# EAGLE design sdlc (EAGLE 4.16)
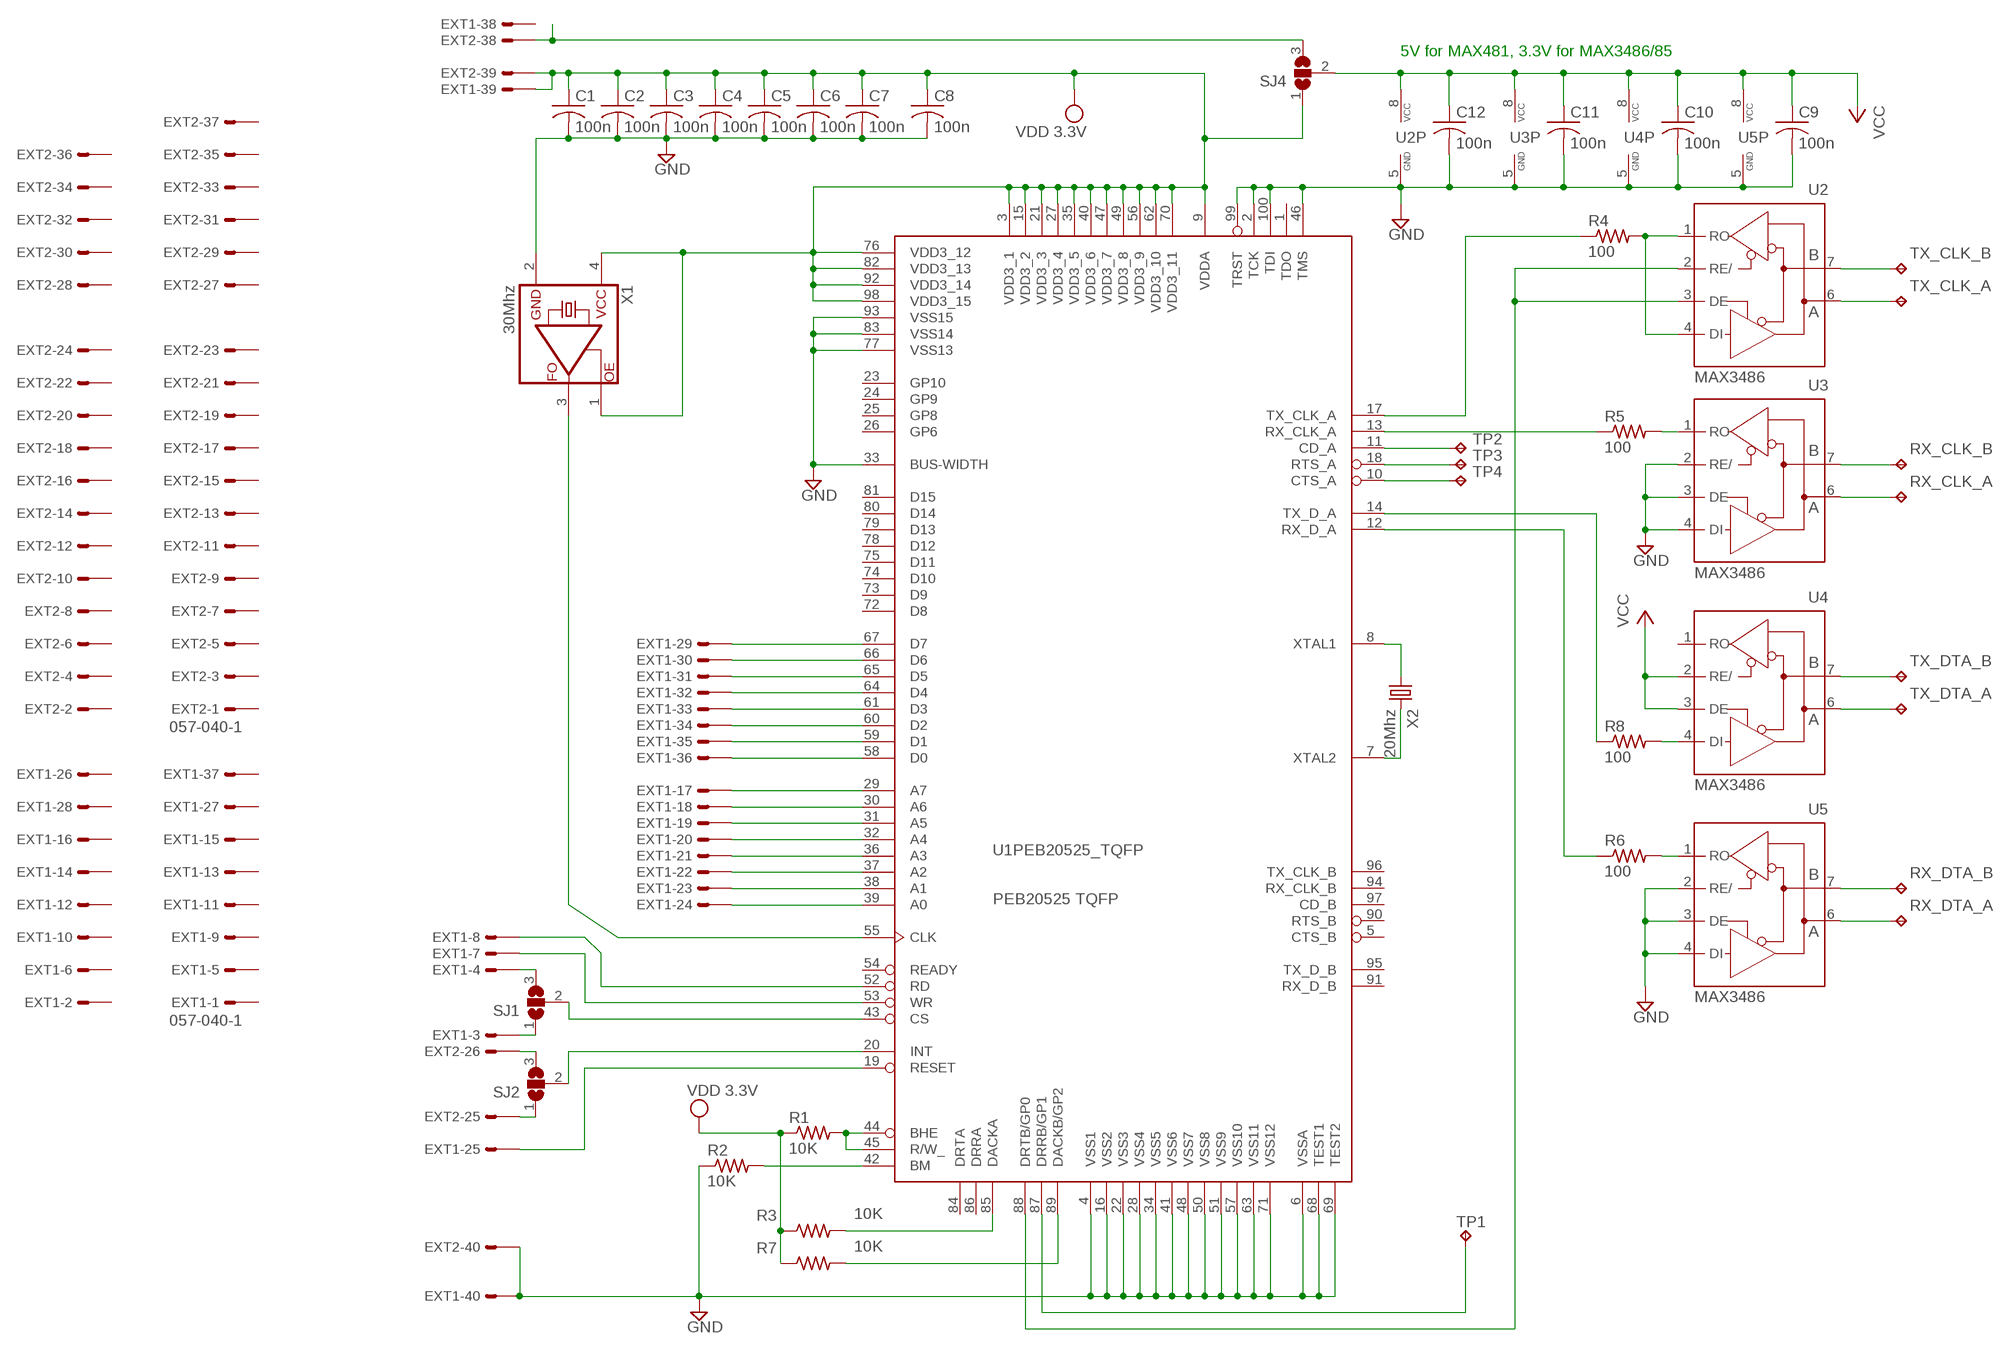
[diagram p0: schematic, sheet 1]

## Parts
C1  100n  C-USC1206  [C1206]
C2  100n  C-USC1206  [C1206]
C3  100n  C-USC1206  [C1206]
C4  100n  C-USC1206  [C1206]
C5  100n  C-USC1206  [C1206]
C6  100n  C-USC1206  [C1206]
C7  100n  C-USC1206  [C1206]
C8  100n  C-USC1206  [C1206]
C9  100n  C-USC1206  [C1206]
C10  100n  C-USC1206  [C1206]
C11  100n  C-USC1206  [C1206]
C12  100n  C-USC1206  [C1206]
EXT1  057-040-1  [057-040-1]
EXT2  057-040-1  [057-040-1]
R1  10K  R-US_M0805  [M0805]
R2  10K  R-US_M0805  [M0805]
R3  10K  R-US_M0805  [M0805]
R4  100  R-US_M0805  [M0805]
R5  100  R-US_M0805  [M0805]
R6  100  R-US_M0805  [M0805]
R7  10K  R-US_M0805  [M0805]
R8  100  R-US_M0805  [M0805]
RX_CLK_A  TPPAD1-13  [P1-13]
RX_CLK_B  TPPAD1-13  [P1-13]
RX_DTA_A  TPPAD1-13  [P1-13]
RX_DTA_B  TPPAD1-13  [P1-13]
SJ1  SJ2W  [SJ_2]
SJ2  SJ2W  [SJ_2]
SJ4  SJ2W  [SJ_2]
TP1  TPPAD1-13  [P1-13]
TP2  TPPAD1-13  [P1-13]
TP3  TPPAD1-13  [P1-13]
TP4  TPPAD1-13  [P1-13]
TX_CLK_A  TPPAD1-13  [P1-13]
TX_CLK_B  TPPAD1-13  [P1-13]
TX_DTA_A  TPPAD1-13  [P1-13]
TX_DTA_B  TPPAD1-13  [P1-13]
U1  PEB20525 TQFP  PEB20525PEB20525-TQFP  [TQFP100]
U2  MAX3486  [SO08]
U3  MAX3486  [SO08]
U4  MAX3486  [SO08]
U5  MAX3486  [SO08]
X1  30Mhz  CB3LV  [SMD7.5X5MM]
X2  20Mhz  CRYSTALHC49S  [HC49/S]

## Nets
GND: C1.2 C2.2 C3.2 C4.2 C5.2 C6.2 C7.2 C8.2 C9.2 C10.2 C11.2 C12.2 EXT1.40 EXT2.40 R2.1 U1.2(TCK) U1.4(VSS1) U1.6(VSSA) U1.16(VSS2) U1.22(VSS3) U1.28(VSS4) U1.33(BUS-WIDTH) U1.34(VSS5) U1.41(VSS6) U1.46(TMS) U1.48(VSS7) U1.50(VSS8) U1.51(VSS9) U1.57(VSS10) U1.63(VSS11) U1.68(TEST1) U1.69(TEST2) U1.71(VSS12) U1.77(VSS13) U1.83(VSS14) U1.93(VSS15) U1.99(TRST) U1.100(TDI) U2.5(GND) U3.2(RE/) U3.3(DE) U3.4(DI) U3.5(GND) U4.5(GND) U5.2(RE/) U5.3(DE) U5.4(DI) U5.5(GND) X1.2(GND)
N$1: EXT1.17 U1.29(PEB20525_TQFP:A7)
N$2: EXT1.18 U1.30(PEB20525_TQFP:A6)
N$3: EXT1.19 U1.31(PEB20525_TQFP:A5)
N$4: EXT1.20 U1.32(PEB20525_TQFP:A4)
N$5: EXT1.21 U1.36(PEB20525_TQFP:A3)
N$6: EXT1.22 U1.37(PEB20525_TQFP:A2)
N$7: EXT1.23 U1.38(PEB20525_TQFP:A1)
N$8: EXT1.24 U1.39(PEB20525_TQFP:A0)
N$9: EXT1.29 U1.67(PEB20525_TQFP:D7)
N$10: EXT1.30 U1.66(PEB20525_TQFP:D6)
N$11: EXT1.31 U1.65(PEB20525_TQFP:D5)
N$12: EXT1.32 U1.64(PEB20525_TQFP:D4)
N$13: EXT1.33 U1.61(PEB20525_TQFP:D3)
N$14: EXT1.34 U1.60(PEB20525_TQFP:D2)
N$15: EXT1.35 U1.59(PEB20525_TQFP:D1)
N$16: EXT1.36 U1.58(PEB20525_TQFP:D0)
N$17: SJ1.2 U1.43(PEB20525_TQFP:CS)
N$18: SJ2.2 U1.20(PEB20525_TQFP:INT)
N$19: EXT1.8 U1.52(PEB20525_TQFP:RD)
N$20: EXT1.7 U1.53(PEB20525_TQFP:WR)
N$21: EXT1.25 U1.19(PEB20525_TQFP:RESET)
N$22: EXT1.3 SJ1.1
N$23: EXT2.26 SJ2.3
N$24: EXT2.25 SJ2.1
N$25: R2.2 U1.42(PEB20525_TQFP:BM)
N$26: R1.2 U1.44(PEB20525_TQFP:BHE) U1.45(PEB20525_TQFP:R/W_)
N$27: EXT1.4 SJ1.3
N$28: R3.2 U1.85(DACKA)
N$29: R4.2 U2.1(RO) U2.4(DI)
N$30: TP1.1(TP) U1.87(DRRB/GP1)
N$31: U1.8(XTAL1) X2.1
N$33: R8.2 U4.4(DI)
N$35: U1.88(DRTB/GP0) U2.2(RE/) U2.3(DE)
N$36: TP2.1(TP) U1.11(CD_A)
N$37: R8.1 U1.14(TX_D_A)
N$38: R5.1 U1.13(RX_CLK_A)
N$39: R6.1 U1.12(RX_D_A)
N$40: R4.1 U1.17(TX_CLK_A)
N$41: TP3.1(TP) U1.18(RTS_A)
N$42: TP4.1(TP) U1.10(CTS_A)
N$43: R5.2 U3.1(RO)
N$44: R6.2 U5.1(RO)
N$45: EXT2.38 SJ4.3
N$47: U1.7(XTAL2) X2.2
N$48: TX_CLK_B.1(TP) U2.7(B)
N$49: TX_CLK_A.1(TP) U2.6(A)
N$50: RX_CLK_B.1(TP) U3.7(B)
N$51: RX_CLK_A.1(TP) U3.6(A)
N$52: TX_DTA_B.1(TP) U4.7(B)
N$53: TX_DTA_A.1(TP) U4.6(A)
N$54: RX_DTA_B.1(TP) U5.7(B)
N$55: RX_DTA_A.1(TP) U5.6(A)
N$56: R7.2 U1.89(DACKB/GP2)
Q2: U1.55(PEB20525_TQFP:CLK) X1.3(FO)
VCC: C9.1 C10.1 C11.1 C12.1 SJ4.2 U2.8(VCC) U3.8(VCC) U4.2(RE/) U4.3(DE) U4.8(VCC) U5.8(VCC)
VDD: C1.1 C2.1 C3.1 C4.1 C5.1 C6.1 C7.1 C8.1 EXT1.39 EXT2.39 R1.1 R3.1 R7.1 SJ4.1 U1.3(VDD3_1) U1.9(VDDA) U1.15(VDD3_2) U1.21(VDD3_3) U1.27(VDD3_4) U1.35(VDD3_5) U1.40(VDD3_6) U1.47(VDD3_7) U1.49(VDD3_8) U1.56(VDD3_9) U1.62(VDD3_10) U1.70(VDD3_11) U1.76(VDD3_12) U1.82(VDD3_13) U1.92(VDD3_14) U1.98(VDD3_15) X1.1(OE) X1.4(VCC) ; supply symbol labelled VDD 3.3V
Unconnected: EXT1.1 EXT1.2 EXT1.5 EXT1.6 EXT1.9 EXT1.10 EXT1.11 EXT1.12 EXT1.13 EXT1.14 EXT1.15 EXT1.16 EXT1.26 EXT1.27 EXT1.28 EXT1.37 EXT1.38 EXT2.1 EXT2.2 EXT2.3 EXT2.4 EXT2.5 EXT2.6 EXT2.7 EXT2.8 EXT2.9 EXT2.10 EXT2.11 EXT2.12 EXT2.13 EXT2.14 EXT2.15 EXT2.16 EXT2.17 EXT2.18 EXT2.19 EXT2.20 EXT2.21 EXT2.22 EXT2.23 EXT2.24 EXT2.27 EXT2.28 EXT2.29 EXT2.30 EXT2.31 EXT2.32 EXT2.33 EXT2.34 EXT2.35 EXT2.36 EXT2.37 U1.1(TDO) U1.5(CTS_B) U1.23(GP10) U1.24(GP9) U1.25(GP8) U1.26(GP6) U1.54(PEB20525_TQFP:READY) U1.72(D8) U1.73(D9) U1.74(D10) U1.75(D11) U1.78(D12) U1.79(D13) U1.80(D14) U1.81(D15) U1.84(DRTA) U1.86(DRRA) U1.90(RTS_B) U1.91(RX_D_B) U1.94(RX_CLK_B) U1.95(TX_D_B) U1.96(TX_CLK_B) U1.97(CD_B) U4.1(RO)

## Notes on the sheet
- 5V for MAX481, 3.3V for MAX3486/85

## Library data of the parts
C1-C12 = rcl:C-US: CAPACITOR, American symbol
EXT1 EXT2 = con-panduit:057-040-: CONNECTOR 40-pin series 057 contact pc board low profile headers
R1-R8 = rcl:R-US_: RESISTOR, American symbol
RX_CLK_A RX_CLK_B RX_DTA_A RX_DTA_B TP1-TP4 TX_CLK_A TX_CLK_B TX_DTA_A TX_DTA_B = ZStofer:TP
SJ1 SJ2 SJ4 = jumper:SJ2W: SMD solder JUMPER
U1 = inf:PEB20525: PEB20525 in TQFP -100
U2-U5 = maxim:MAX3486: RS422/485 transceiver 3.3V
X1 = crystal:CB3LV
X2 = crystal:CRYSTAL: CRYSTAL

## Board
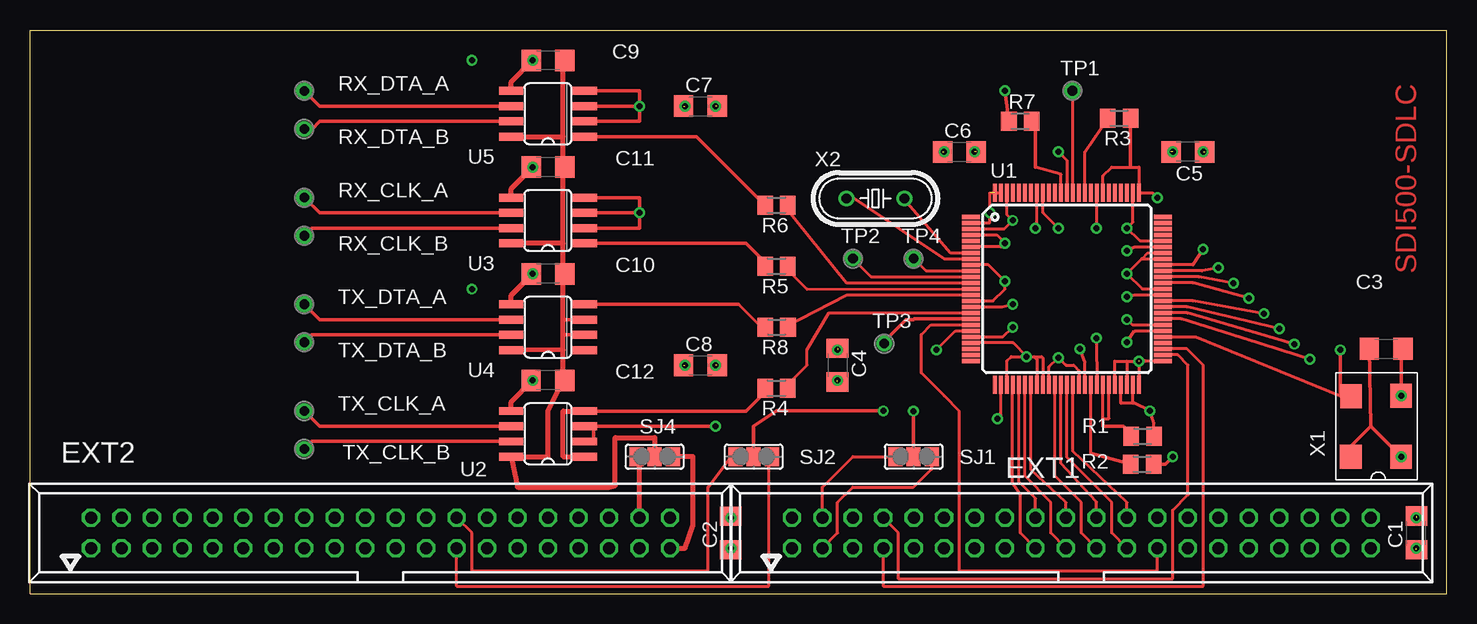
[diagram p1: board, top side]
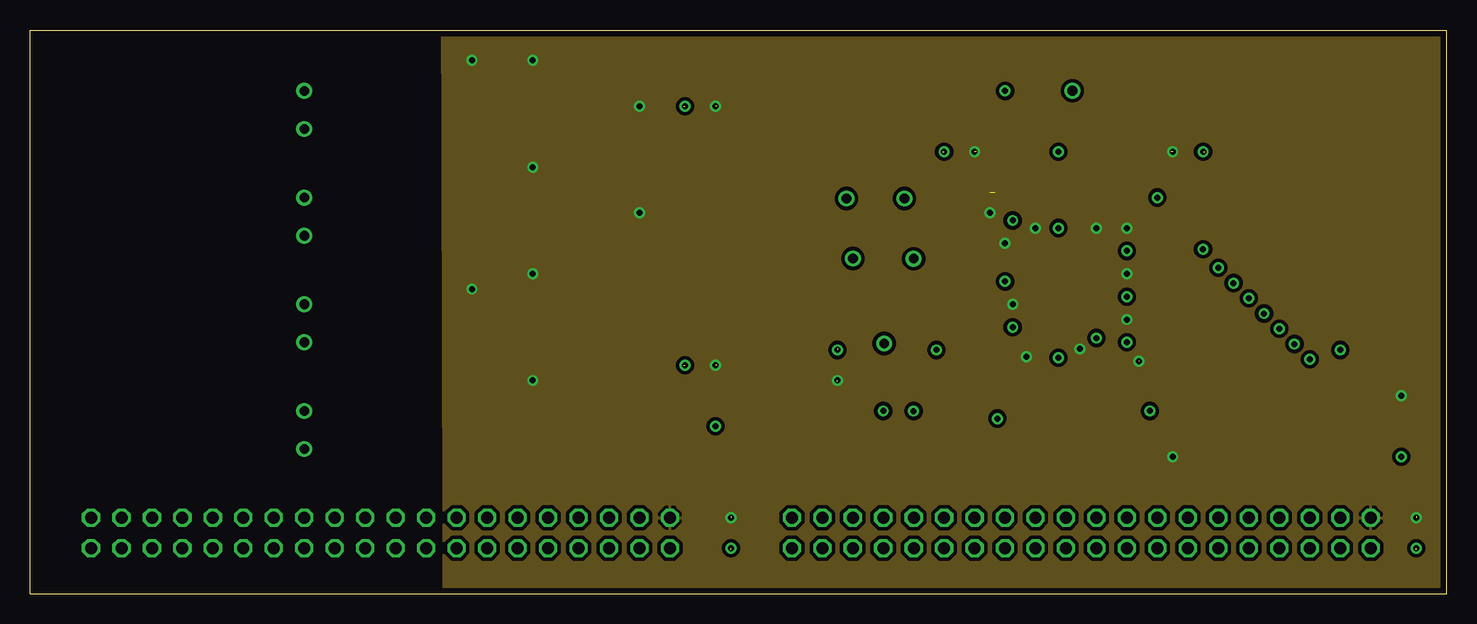
[diagram p2: board, inner layer Route2]
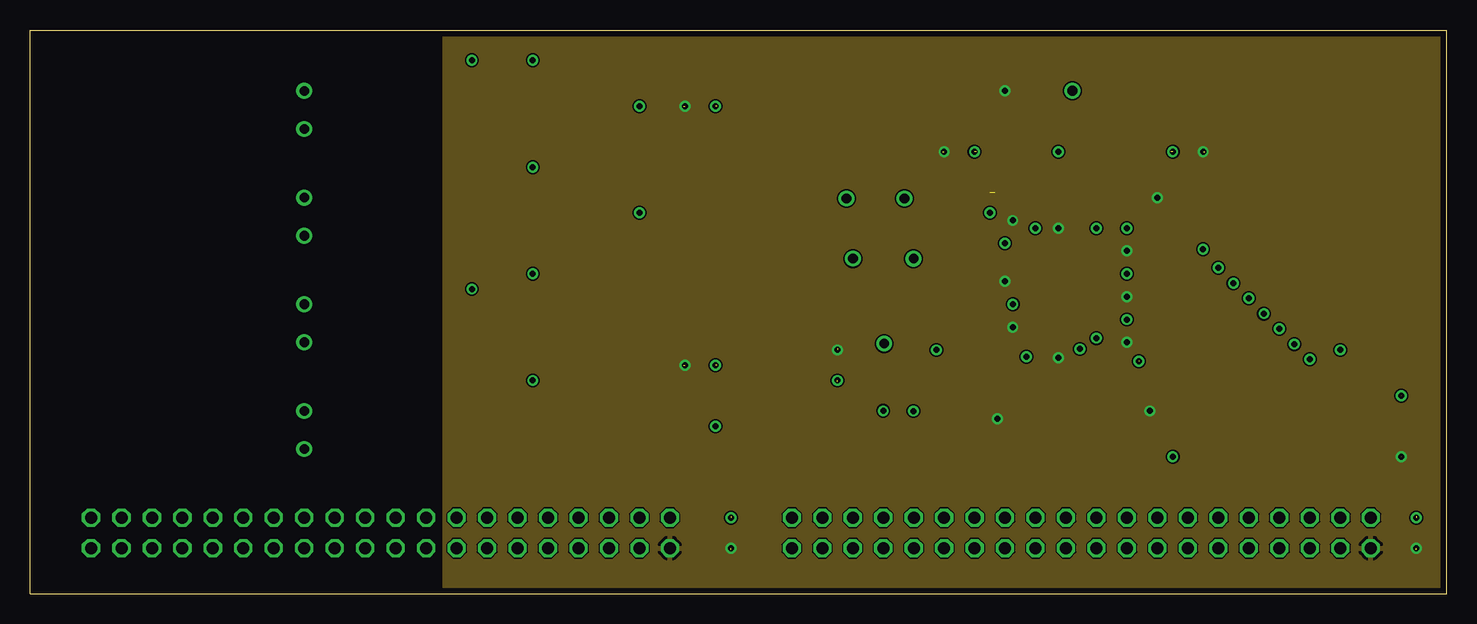
[diagram p3: board, inner layer Route15]
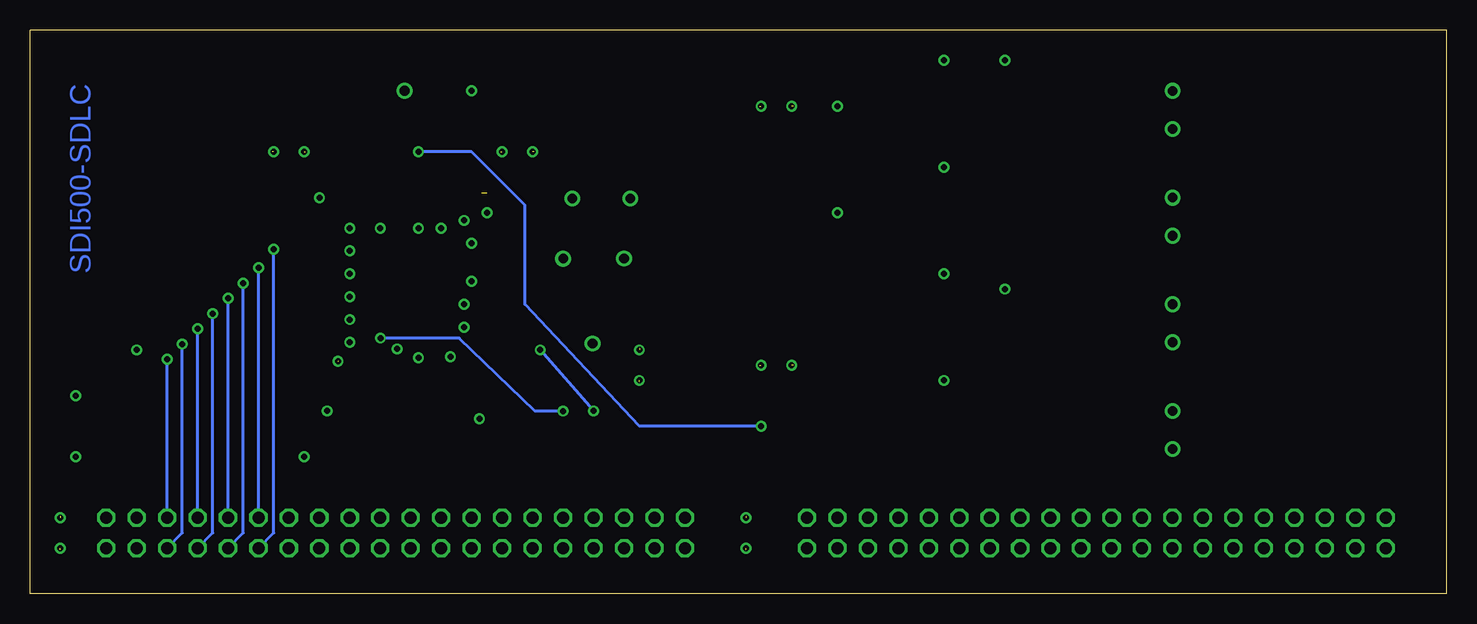
[diagram p4: board, bottom side, seen from below]

Size 118.11 x 46.99 mm. Coordinates in mm from the lower left corner, seen from the top.
Outline: 0,0 118.11,0 118.11,46.99 0,46.99 0,0
Copper layers (1*2+15*16): Top 0.035mm / dielectric 0.2mm / Route2 0.035mm / dielectric 0.15mm / Route15 0.035mm / dielectric 0.2mm / Bottom 0.035mm
Design rules "my": minimum track width 5mil, minimum drill 10mil, track to track 5mil, track to pad 5mil, pad to pad 5mil, via to via 5mil, smd to smd 5mil, copper to edge 20mil, drill to drill 8mil, minimum pad ring 10mil, minimum via ring 8mil, stop-mask expansion 4mil, vias tented up to drill 0mil, thermal gap 10mil

### Footprints (pad centres in the part's own frame; a part is rotated, then mirrored left to right if it is on the bottom)
C1206 = smd 1.6 x 1.8: 1 -1.4,0; 2 1.4,0
057-040-1 = drill 1 octagon: 1 -24.13,-1.27; 2 -24.13,1.27; 3 -21.59,-1.27; 4 -21.59,1.27; 5 -19.05,-1.27; 6 -19.05,1.27; 7 -16.51,-1.27; 8 -16.51,1.27; 9 -13.97,-1.27; 10 -13.97,1.27; 11 -11.43,-1.27; 12 -11.43,1.27; 13 -8.89,-1.27; 14 -8.89,1.27; 15 -6.35,-1.27; 16 -6.35,1.27; 17 -3.81,-1.27; 18 -3.81,1.27; 19 -1.27,-1.27; 20 -1.27,1.27; 21 1.27,-1.27; 22 1.27,1.27; 23 3.81,-1.27; 24 3.81,1.27; 25 6.35,-1.27; 26 6.35,1.27; 27 8.89,-1.27; 28 8.89,1.27; 29 11.43,-1.27; 30 11.43,1.27; 31 13.97,-1.27; 32 13.97,1.27; 33 16.51,-1.27; 34 16.51,1.27; 35 19.05,-1.27; 36 19.05,1.27; 37 21.59,-1.27; 38 21.59,1.27; 39 24.13,-1.27; 40 24.13,1.27
M0805 = smd 1.3 x 1.6: 1 -0.95,0; 2 0.95,0
P1-13 = drill 0.813 round: 1 0,0
SJ_2 = smd 1.168 x 1.6: 1 -1.524,0; 2 0,0; 3 1.524,0
TQFP100 = smd 1.5 x 0.35: 1 -8,6; 2 -8,5.5; 3 -8,5; 4 -8,4.5; 5 -8,4; 6 -8,3.5; 7 -8,3; 8 -8,2.5; 9 -8,2; 10 -8,1.5; 11 -8,1; 12 -8,0.5; 13 -8,0; 14 -8,-0.5; 15 -8,-1; 16 -8,-1.5; 17 -8,-2; 18 -8,-2.5; 19 -8,-3; 20 -8,-3.5; 21 -8,-4; 22 -8,-4.5; 23 -8,-5; 24 -8,-5.5; 25 -8,-6; 51 8,-6; 52 8,-5.5; 53 8,-5; 54 8,-4.5; 55 8,-4; 56 8,-3.5; 57 8,-3; 58 8,-2.5; 59 8,-2; 60 8,-1.5; 61 8,-1; 62 8,-0.5; 63 8,0; 64 8,0.5; 65 8,1; 66 8,1.5; 67 8,2; 68 8,2.5; 69 8,3; 70 8,3.5; 71 8,4; 72 8,4.5; 73 8,5; 74 8,5.5; 75 8,6 | smd 0.35 x 1.5: 26 -6,-8; 27 -5.5,-8; 28 -5,-8; 29 -4.5,-8; 30 -4,-8; 31 -3.5,-8; 32 -3,-8; 33 -2.5,-8; 34 -2,-8; 35 -1.5,-8; 36 -1,-8; 37 -0.5,-8; 38 0,-8; 39 0.5,-8; 40 1,-8; 41 1.5,-8; 42 2,-8; 43 2.5,-8; 44 3,-8; 45 3.5,-8; 46 4,-8; 47 4.5,-8; 48 5,-8; 49 5.5,-8; 50 6,-8; 76 6,8; 77 5.5,8; 78 5,8; 79 4.5,8; 80 4,8; 81 3.5,8; 82 3,8; 83 2.5,8; 84 2,8; 85 1.5,8; 86 1,8; 87 0.5,8; 88 0,8; 89 -0.5,8; 90 -1,8; 91 -1.5,8; 92 -2,8; 93 -2.5,8; 94 -3,8; 95 -3.5,8; 96 -4,8; 97 -4.5,8; 98 -5,8; 99 -5.5,8; 100 -6,8
SO08 = smd 0.66 x 2.032: 1 -1.905,-3.073; 2 -0.635,-3.073; 3 0.635,-3.073; 4 1.905,-3.073; 5 1.905,3.073; 6 0.635,3.073; 7 -0.635,3.073; 8 -1.905,3.073
SMD7.5X5MM = smd 2.007 x 1.803: 1 0,0; 2 5.08,0; 3 5.052,4.171; 4 0,4.191
HC49/S = drill 0.813 round: 1 -2.413,0; 2 2.413,0

### Placement (x,y rotation side)
C1  115.58,5.09 90 top
C2  58.43,5.08 90 top
C3  113.05,20.42 0 top
C4  67.31,19.06 270 top
C5  96.52,36.83 180 top
C6  77.47,36.83 0 top
C7  55.88,40.64 0 top
C8  55.88,19.05 0 top
C9  43.19,44.45 180 top
C10  43.19,26.67 180 top
C11  43.19,35.56 180 top
C12  43.18,17.79 180 top
EXT1  87.64,5.09 0 top
EXT2  29.22,5.09 0 top
R1  92.75,13.14 180 top
R2  92.71,10.81 180 top
R3  90.79,39.64 180 top
R4  62.23,17.14 180 top
R5  62.23,27.3 180 top
R6  62.23,32.38 180 top
R7  82.56,39.37 0 top
R8  62.23,22.23 180 top
RX_CLK_A  22.87,33.02 0 top
RX_CLK_B  22.87,29.85 0 top
RX_DTA_A  22.87,41.91 0 top
RX_DTA_B  22.87,38.74 0 top
SJ1  73.66,11.43 180 top
SJ2  60.33,11.43 180 top
SJ4  52.07,11.43 180 top
TP1  86.89,41.92 0 top
TP2  68.59,27.94 0 top
TP3  71.21,20.86 0 top
TP4  73.66,27.94 0 top
TX_CLK_A  22.87,15.24 0 top
TX_CLK_B  22.87,12.07 0 top
TX_DTA_A  22.87,24.13 0 top
TX_DTA_B  22.87,20.96 0 top
U1  86.45,25.41 0 top
U2  43.18,13.33 90 top
U3  43.18,31.11 90 top
U4  43.18,22.23 90 top
U5  43.18,40 90 top
X1  114.3,11.43 90 top
X2  70.49,32.95 0 top

### Tracks (layer width: path | path; a pad name or v marks a point on that pad's centre or on a via)
GND  (via drill 0.5)  (10 unrouted)
  Top 0.254: 92.92,19.41 92.45,19.41 U1.50 92.42,17.41 | 92.92,19.41 U1.51 | U1.48 91.42,17.4 91.42,19.4 | 92.92,19.41 92.92,19.4 91.42,19.4 | U1.46 90.42,17.4 90.42,19.4 91.42,19.4 | U1.41 87.95,19.34 v87.51,20.41 | U1.28 81.45,19.42 81.8,19.77 v83.07,19.77 | v83.07,19.77 83.7,19.77 | 83.7,19.77 84.34,19.77 84.45,19.66 U1.34 | U1.33 83.95,19.53 83.7,19.77 | U1.57 91.9,22.41 v91.44,22.86 | U1.63 92.71,25.41 v91.44,26.67 92.68,27.91 | 92.68,27.91 U1.68 | 92.68,27.91 92.68,27.94 92.72,27.94 93.18,28.41 U1.69 | U1.71 92.52,29.41 v91.44,30.48 91.95,30.99 U1.77 | U1.16 81.06,23.91 v81.92,24.13 | U1.4 80.59,29.91 v81.28,29.21 80.98,28.91 U1.6 | U1.99 80.02,33.41 v80.02,31.75 80.02,30.91 U1.2 | U1.93 83.95,30.61 v83.83,30.48 | U1.83 88.95,30.53 v88.91,30.48 | 114.31,20.32 C3.2 | 83.11,19.77 83.19,19.69 | v83.07,19.77 83.11,19.77 | U1.22 81.97,20.91 83.11,19.77 | v41.91,44.45 C9.2 | v41.91,35.56 C11.2 | v41.91,26.67 C10.2 | v41.91,17.78 v41.91,17.79 C12.2 | 50.8,30.48 | 50.8,33.02 | 50.8,39.37 | 45.73,41.91 U5.4 | v50.8,40.64
  Top 0.305: X1.2 114.31,20.32 | R2.1 94.63,10.81 v95.25,11.43 | U3.2 50.8,30.48 | 50.8,30.48 v50.8,31.75 | 50.8,33.02 U3.4 | v50.8,31.75 50.8,33.02 | 50.8,39.37 U5.2 | 50.8,39.37 v50.8,40.64 50.8,41.91 45.73,41.91 | U5.3 v50.8,40.64 | U3.3 v50.8,31.75
  Top 0.406: U5.5 40.11,42.65 v41.91,44.45 | U3.5 40.11,33.76 v41.91,35.56 | U4.5 40.11,24.87 v41.91,26.67 | U2.5 40.11,15.98 v41.91,17.78
  other vias: 92.44,19.39 115.58,6.35 58.42,6.35 114.31,16.51 95.25,36.83 67.31,17.78 78.75,36.83 57.16,19.05 57.16,40.64 36.84,44.45 36.84,25.4
  pour Route2 (isolate 0.305): 34.41,50.72 123.31,50.72 122.81,-8.27 34.55,-8.27
N$1
  Top 0.254: EXT1.17 82.56,5.09 82.56,8.26 81.92,9.2 81.92,17.38 U1.29 81.94,17.42 U1.29
N$2
  Top 0.254: EXT1.18 83.83,7.97 82.45,9.33 82.45,16.91 U1.30
N$3
  Top 0.254: EXT1.19 85.1,5.09 85.1,7.63 82.95,9.83 82.95,16.91 U1.31
N$4
  Top 0.254: EXT1.20 86.37,7.63 83.45,10.33 83.45,16.91 U1.32
N$5
  Top 0.254: EXT1.21 87.64,5.09 87.64,7.63 85.45,9.83 U1.36
N$6
  Top 0.254: EXT1.22 88.91,7.67 85.95,10.87 85.95,16.91 U1.37
N$7
  Top 0.254: EXT1.23 90.18,5.09 90.18,7.63 86.45,11.37 U1.38
N$8
  Top 0.254: EXT1.24 91.45,7.63 86.95,11.87 86.95,16.91 U1.39
N$9  (via drill 0.5)
  Top 0.254: U1.67 94.95,27.41 96.95,27.41 v97.79,28.71
  Bottom 0.254: EXT1.29 97.8,5.09 v97.79,28.71
N$10  (via drill 0.5)
  Top 0.254: v99.06,27.17 97.72,26.91 94.95,26.91 U1.66
  Bottom 0.254: EXT1.30 v99.06,27.17
N$11  (via drill 0.5)
  Top 0.254: v100.33,25.9 97.45,26.41 94.95,26.41 U1.65
  Bottom 0.254: EXT1.31 100.34,5.09 v100.33,25.9
N$12  (via drill 0.5)
  Top 0.254: v101.6,24.63 96.95,25.91 94.95,25.91 U1.64
  Bottom 0.254: EXT1.32 v101.6,24.63
N$13  (via drill 0.5)
  Top 0.254: v102.87,23.36 96.95,24.41 94.95,24.41 U1.61
  Bottom 0.254: EXT1.33 102.88,5.09 v102.87,23.36
N$14  (via drill 0.5)
  Top 0.254: v104.14,22.09 96.45,23.91 94.95,23.91 U1.60
  Bottom 0.254: EXT1.34 v104.14,22.09
N$15  (via drill 0.5)
  Top 0.254: v105.41,20.82 96.45,23.41 94.95,23.41 U1.59
  Bottom 0.254: EXT1.35 105.42,5.09 v105.41,20.82
N$16  (via drill 0.5)
  Top 0.254: v106.68,19.55 95.95,22.91 94.95,22.91 U1.58
  Bottom 0.254: EXT1.36 v106.68,19.55
N$17  (via drill 0.5)
  Top 0.254: U1.43 v88.9,21.32 | v73.66,15.24 v73.67,15.24 v73.66,15.24
  Top 0.305: SJ1.2 v73.66,15.24
  Bottom 0.254: v73.66,15.24 76.01,15.24 82.32,21.32 v88.9,21.32
N$18  (via drill 0.5)
  Top 0.254: U1.20 77.15,21.91 v75.57,20.32 | SJ2.2
  Top 0.305: SJ2.2 60.33,13.97 62.23,15.24 v71.12,15.24
  Bottom 0.254: v71.12,15.24 v75.57,20.32
N$19
  Top 0.254: EXT1.8 72.39,5.08 72.39,1.27 95.25,1.27 95.25,6.99 96.53,8.26 96.53,19.05 95.67,19.91 U1.52
N$20
  Top 0.254: U1.53 96.44,20.41 97.8,19.05 97.8,0.64 71.12,0.64 71.13,0.64 EXT1.7
N$21
  Top 0.254: U1.19 | U1.19 78.95,22.41 | EXT1.25 93.98,1.91 77.47,1.91 77.47,15.24 76.21,16.51 74.3,18.42 74.3,21.59 75.11,22.41 U1.19
N$22
  Top 0.254: EXT1.3 67.31,5.08 67.31,7.62 68.59,8.89 73.67,8.89 75.19,10.42 SJ1.1
N$23
  Top 0.254: EXT2.26 36.84,5.08 36.84,1.91 56.52,1.91 56.52,8.89 58.42,11.43 SJ2.3
N$24
  Top 0.254: SJ2.1 62.23,11.43 61.6,10.8 61.6,0.64 35.56,0.64 35.57,0.64 EXT2.25
N$25
  Top 0.254: U1.42 88.45,11.74
  Top 0.305: 88.45,11.74 R2.2
N$26
  Top 0.254: U1.44 89.45,14.61 89.95,14.61 U1.45
  Top 0.305: R1.2 91.17,13.97 89.45,13.97 89.45,14.61
N$27
  Top 0.254: EXT1.4 66.05,8.89 68.59,11.43 72.39,11.43 SJ1.3
N$28
  Top 0.254: U1.85 87.94,36.86 87.99,36.88 R3.2
N$29
  Top 0.254: 61.6,17.15 R4.2 | 44.45,15.24 44.46,15.24 | 45.73,11.43 U2.1
  Top 0.305: U2.4 59.69,15.24 61.6,17.15
  Top 0.406: 44.46,15.24 U2.4 | 44.45,15.24 44.45,11.43 45.73,11.43
N$30
  Top 0.254: TP1.1 86.99,41.93 87,41.91 86.95,41.86 U1.87
N$31
  Top 0.254: U1.8 76.2,27.91 76.2,27.94 68.59,33.02 X2.1
N$33
  Top 0.254: R8.2 60.97,22.23 59.06,24.13
  Top 0.305: U4.4 59.06,24.13
N$35  (via drill 0.5)
  Top 0.254: U1.88 86.45,36.12 v85.73,36.83 | U2.2 45.73,12.7 46.99,12.7 | U2.3 45.73,13.97 46.99,13.97
  Top 0.305: v57.16,13.97 46.99,13.97 46.99,12.7
  Bottom 0.254: v85.73,36.83 81.28,36.83 76.84,32.39 76.84,24.13 67.31,13.97 v57.16,13.97
N$36
  Top 0.254: TP2.1 70.12,26.41 U1.11
N$37
  Top 0.254: R8.1 62.87,22.23 68.09,24.91 U1.14
N$38
  Top 0.254: U1.13 64.78,25.4 62.87,27.31 R5.1
N$39
  Top 0.254: U1.12 68.08,25.91 62.87,32.39 R6.1
N$40
  Top 0.254: U1.17 66.59,23.41 64.78,20.32 64.78,19.05 62.87,17.15 R4.1
N$41
  Top 0.305: U1.18 73.71,22.91 73.67,22.86 73.03,22.86 71.12,20.96 TP3.1
N$42
  Top 0.254: TP4.1 74.7,26.91 U1.10
N$43
  Top 0.254: R5.2 60.97,27.31
  Top 0.305: U3.1 59.7,29.21 61.28,27.63 R5.2
N$44
  Top 0.254: R6.2 60.97,32.39
  Top 0.305: R6.2 55.56,38.1 U5.1
N$45
  Top 0.305: 50.81,10.16 50.8,10.16 | 50.17,11.43 | 50.17,11.43 SJ4.3 | 50.8,10.8 50.17,11.43
  Top 0.406: EXT2.38 50.81,10.16 | 50.8,10.16 50.8,10.8
N$47
  Top 0.254: U1.7 76.74,28.41 72.86,32.94 X2.2
N$48
  Top 0.305: U2.7 23.5,12.7 TX_CLK_B.1
N$49
  Top 0.305: U2.6 24.14,13.97 TX_CLK_A.1
N$50
  Top 0.305: U3.7 23.5,30.48 RX_CLK_B.1
N$51
  Top 0.305: U3.6 24.14,31.75 RX_CLK_A.1
N$52
  Top 0.305: U4.7 23.5,21.59 TX_DTA_B.1
N$53
  Top 0.305: U4.6 24.14,22.86 TX_DTA_A.1
N$54
  Top 0.305: RX_DTA_B.1 23.5,38.74 24.13,39.37 U5.7
N$55
  Top 0.305: U5.6 24.14,40.64 RX_DTA_A.1
N$56
  Top 0.254: U1.89 85.94,34.96 83.83,35.56 | 83.83,39.37 R7.2
  Top 0.305: 83.83,35.56 83.83,39.37
Q2  (via drill 0.5)
  Top 0.254: 94.95,21.41 U1.55 94.95,21.41 arc90 94.95,21.41 | 94.95,21.41 97.17,21.41 109.22,16.51 110.5,16.51 X1.3
  Top 0.305: 109.22,16.51 v109.22,20.32
VCC
  Top 0.305: 52.08,12.7 52.07,12.7 | 44.45,17.78 C12.1 | 46.3,21.55 U4.2 44.45,21.59 | 44.45,26.67 C10.1 | U4.3 44.45,22.86 | 44.45,35.56 C11.1 | U3.8 | U5.8 44.45,38.1 | 44.45,44.45 C9.1
  Top 0.406: 52.07,12.7 SJ4.2 | 52.08,12.7 52.06,13.03 48.79,13.03 48.79,9.02 48.27,8.89 40.65,8.89 U2.8 43.19,11.43 43.19,15.24 44.45,17.78 44.45,20.32 | 44.45,20.32 U4.8 | 44.45,20.32 44.45,22.86 44.45,26.67 44.45,29.21 | 44.45,20.32 44.45,21.59 | 44.45,29.21 44.45,35.56 44.45,38.1 | 44.45,29.21 U3.8 | U5.8 44.45,38.1 44.45,44.45
VDD  (via drill 0.5)  (8 unrouted)
  Top 0.254: 90.92,16.9 U1.47 90.95,15.88 91.95,15.88 | U1.56 92.08,21.91 v91.44,20.96 | U1.62 92.08,24.91 v91.44,24.77 | U1.70 92.08,28.91 v91.44,28.58 | v93.98,33.02 93.6,33.41 U1.76 92.45,35.56 91.74,35.56 | U1.35 84.95,18.91 v85.73,19.69 86.36,19.05 87,19.05 87.45,18.61 U1.40 | U1.27 80.95,14.91 v80.65,14.61 | U1.9 79.92,27.41 v81.28,26.04 81.28,25.4 80.29,24.41 U1.15 | U1.3 81.21,30.41 v81.92,31.12 81.45,31.59 U1.98 | U1.92 84.45,31.77 v85.73,30.48 | U1.82 89.45,34.84 90.17,35.56 91.74,35.56 | 111.77,13.97 111.76,13.97 | R1.1 93.7,14.26 v93.35,15.24 92.08,15.88 91.95,15.88 | X1.4 110.11,12.32 | X1.1 | U1.21 81.1,21.41 v81.92,22.23 | 91.74,35.56 91.74,35.54 | U1.49 91.95,15.88
  Top 0.305: 111.77,13.97 C3.1 | 110.11,12.32 111.77,13.97 | 111.77,13.97 X1.1 | 91.74,35.54 R3.1 | R7.1 v81.28,41.91 | 53.98,11.43 SJ4.1
  Top 0.406: EXT2.39 54.62,3.82 55.25,5.72 55.25,11.43 53.98,11.43
  other vias: 115.58,3.81 114.31,11.43 58.42,3.81 97.8,36.83 67.31,20.32 76.2,36.83 54.62,40.64 54.62,19.05
  pour Route15: 34.61,50.88 123.12,50.88 123.12,-7.23 34.74,-6.59 34.74,-0.59 34.61,-6.31

### Text on the board
Top: SDI500-SDLC
Bottom: SDI500-SDLC
Drill_legend: Drill legend | Date: 11/12/2007 03:30:09p | 1.0000 mm / 39.370 mil | 0.8128 mm / 32.000 mil | 0.5000 mm / 19.685 mil